# EAGLE schematic Prism_connection_diagram (EAGLE 9.4.2)
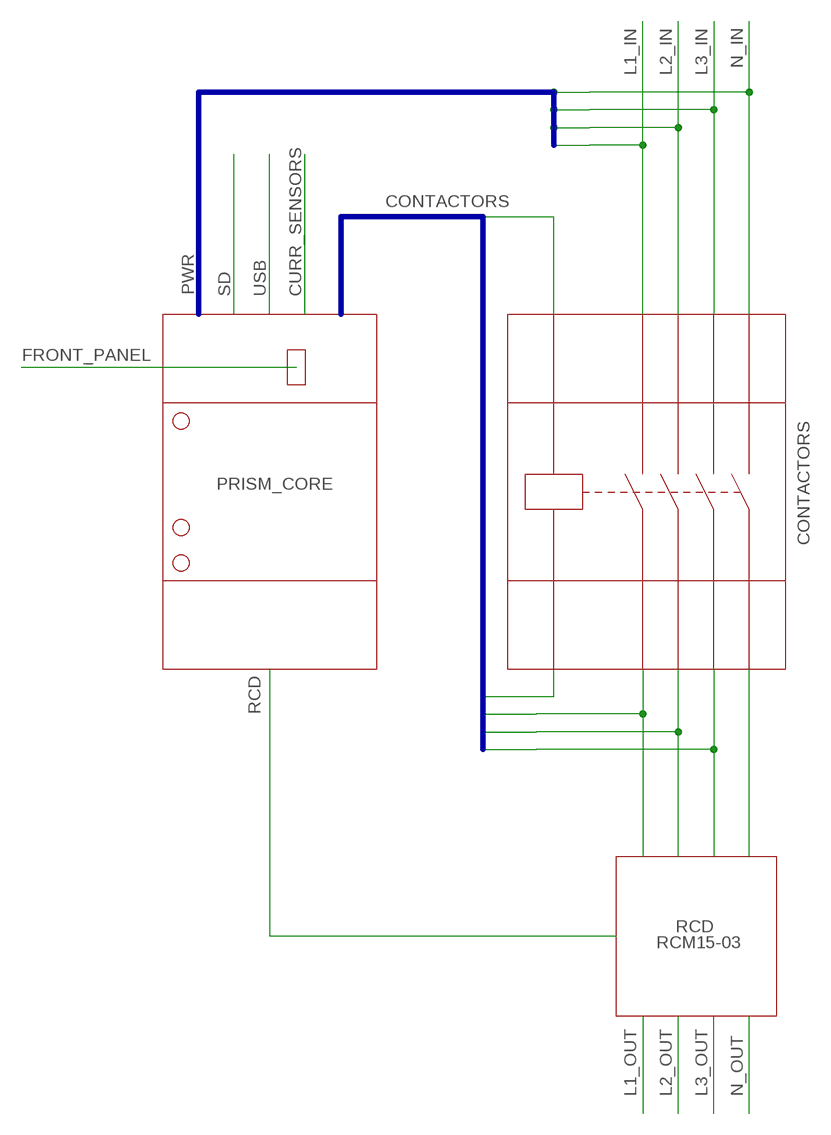
[diagram p0: schematic, sheet 1]

## Parts
CONTACTORS  CONTACTORS  [PRISM_CORE]
PRISM_CORE  PRISM_CORE  [PRISM_CORE]
RCD  RCM15-03  RCD  [RCD]

## Nets
CONTACTORS: CONTACTORS.P1 PRISM_CORE.P1
CURR_SENSORS: PRISM_CORE.P2
FRONT_PANEL: PRISM_CORE.P11
L1_IN: CONTACTORS.P9
L1_OUT: CONTACTORS.P10 CONTACTORS.P11(P10)
L2_IN: CONTACTORS.P2
L2_OUT: CONTACTORS.P6
L3_IN: CONTACTORS.P3
L3_OUT: CONTACTORS.P7
N$2: CONTACTORS.P5
N_IN: CONTACTORS.P4
N_OUT: CONTACTORS.P8
PWR: PRISM_CORE.P5
RCD: PRISM_CORE.P8 RCD.P0(P1)
SD: PRISM_CORE.P4
USB: PRISM_CORE.P3
Unconnected: PRISM_CORE.P6 PRISM_CORE.P7 PRISM_CORE.P9 PRISM_CORE.P10

## Buses
CONTACTORS,CURR_SENSORS,FRONT_PANEL,L1_IN,L1_OUT,L2_IN,L2_OUT,L3_IN,L3_OUT,N$1,N$2,N$3,N$4,N_IN,N_OUT,PWR,RCD,SD,USB
PWR

## Library data of the parts
CONTACTORS = Prism:CONTACTORS
PRISM_CORE = Prism:PRISM_CORE
RCD = Prism:RCD